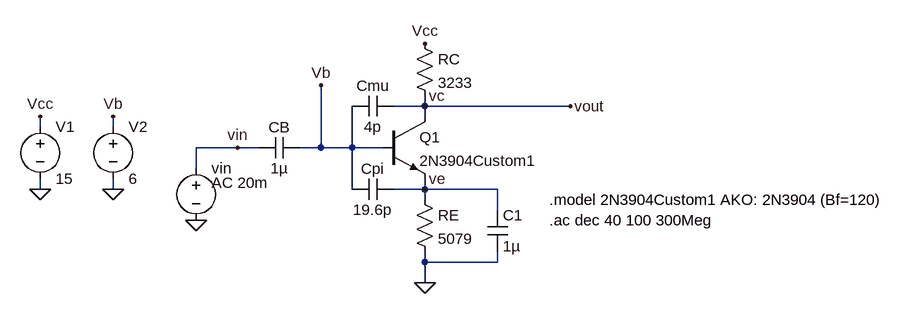
[diagram p0: schematic amp_a.asc]
amp_a.asc, the LTspice schematic file:
Version 4
SHEET 1 1252 680
WIRE 528 160 528 144
WIRE 528 160 480 160
WIRE 752 160 528 160
WIRE 528 176 528 160
WIRE -64 192 -64 176
WIRE 48 192 48 176
WIRE 240 224 176 224
WIRE 272 224 240 224
WIRE 368 224 368 128
WIRE 368 224 336 224
WIRE 416 224 416 160
WIRE 416 224 368 224
WIRE 464 224 416 224
WIRE 176 256 176 224
WIRE -64 288 -64 272
WIRE 48 288 48 272
WIRE 416 288 416 224
WIRE 528 288 528 272
WIRE 528 288 480 288
WIRE 640 288 528 288
WIRE 528 304 528 288
WIRE 640 320 640 288
WIRE 528 400 528 384
WIRE 640 400 640 384
WIRE 640 400 528 400
WIRE 528 432 528 400
FLAG 240 224 vin
FLAG 528 160 vc
FLAG 368 128 Vb
FLAG 528 64 Vcc
FLAG 752 160 vout
FLAG 528 432 0
FLAG -64 288 0
FLAG -64 176 Vcc
FLAG 528 288 ve
FLAG 48 288 0
FLAG 48 176 Vb
FLAG 176 336 0
SYMBOL Cap 336 208 R90
WINDOW 0 0 32 VBottom 2
WINDOW 3 32 32 VTop 2
SYMATTR InstName CB
SYMATTR Value 1µ
SYMBOL Res 512 48 R0
SYMATTR InstName RC
SYMATTR Value 3233
SYMBOL Res 512 288 R0
SYMATTR InstName RE
SYMATTR Value 5079
SYMBOL Voltage -64 176 R0
SYMATTR InstName V1
SYMATTR Value 15
SYMBOL npn 464 176 R0
SYMATTR InstName Q1
SYMATTR Value 2N3904Custom1
SYMBOL Cap 624 320 R0
SYMATTR InstName C1
SYMATTR Value 1µ
SYMBOL Voltage 48 176 R0
SYMATTR InstName V2
SYMATTR Value 6
SYMATTR SpiceLine Rser=1050
SYMBOL Voltage 176 240 R0
WINDOW 123 24 38 Left 2
SYMATTR Value2 AC 20m
SYMATTR InstName vin
SYMATTR Value ""
SYMBOL Cap 416 176 R270
WINDOW 0 32 32 VTop 2
WINDOW 3 0 32 VBottom 2
SYMATTR InstName Cmu
SYMATTR Value 4p
SYMBOL Cap 480 272 R90
WINDOW 0 0 32 VBottom 2
WINDOW 3 32 32 VTop 2
SYMATTR InstName Cpi
SYMATTR Value 19.6p
TEXT 720 304 Left 2 !.model 2N3904Custom1 AKO: 2N3904 (Bf=120)
TEXT 720 336 Left 2 !.ac dec 40 100 300Meg

The netlist it stands for:
* amp_a.asc
CB Vb vin 1µ
RC Vcc vout 3233
RE ve 0 5079
V1 Vcc 0 15
Q1 vout Vb ve 0 2N3904Custom1
C1 ve 0 1µ
V2 Vb 0 6 Rser=1050
vin vin 0 AC 20m
Cmu Vb vout 4p
Cpi ve Vb 19.6p
.model NPN NPN
.model PNP PNP
.lib standard.bjt
.model 2N3904Custom1 AKO: 2N3904 (Bf=120)
.ac dec 40 100 300Meg
.backanno
.end